# Altium project RBR-RAMON.PrjPcb
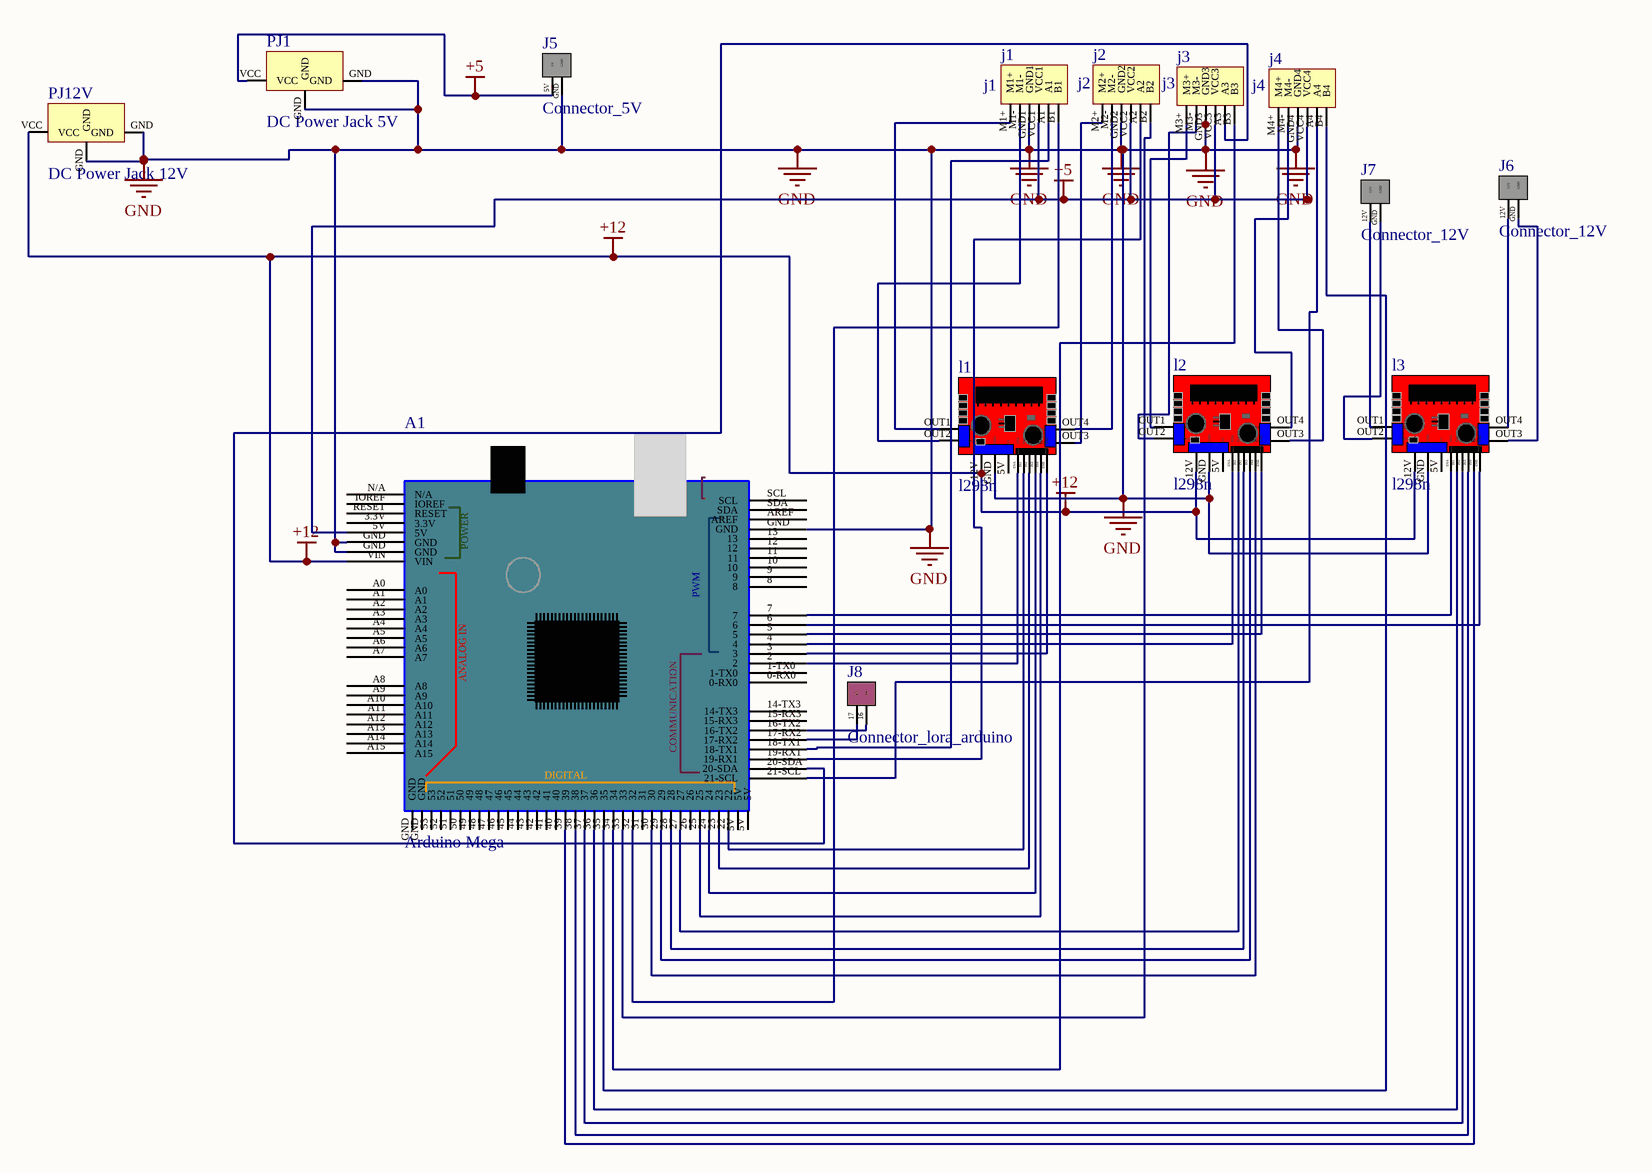
[diagram p0: RBR-RAMON.SchDoc]
2 sheets, 23 parts. Net scope: global (net labels, ports and power ports of the same name join across sheets).
Board file: RBR-RAMON2.PcbDoc
Sheets:
  RBR-RAMON.SchDoc
  Antena_lora_receptora.SchDoc

## Sheet RBR-RAMON.SchDoc
size A4; SheetNumber: 1; SheetTotal: 1

### Parts
A1  Arduino Mega  [Arduino Mega]
j1  j1  [CONECTOR JST M1]
j2  j2  [CONECTOR JST M2]
j3  j3  [CONECTOR JST M3]
j4  j4  [CONECTOR JST M4]
J5  Connector_5V  [Conector_5V]
J6  Connector_12V  [Conector_12V]
J7  Connector_12V  [Conector_12V]
J8  Connector_lora_arduino  [Conector_lora_arduino]
l1  l298n  [L298N_Conectores]
l2  l298n  [L298N_Conectores]
l3  l298n  [L298N_Conectores]
PJ1  DC Power Jack 5V  [DC Power Jack5V]
PJ12V  DC Power Jack 12V  [DC Power Jack12V]

### Nets
+5: A1.5V j1.VCC1 j2.VCC2 j3.VCC3 j4.VCC4 J5.5V PJ1.VCC
+12: A1.VIN l1.12V l2.12V l3.12V PJ12V.VCC
GND: A1.GND j1.GND1 j2.GND2 j3.GND3 j4.GND4 J5.GND l1.GND l2.GND l3.GND PJ1.GND PJ12V.GND
NetA1_2: A1.2 l1.ENA(SDA)
NetA1_3: A1.3 l1.ENB
NetA1_4: A1.4 l2.ENA(SDA)
NetA1_5: A1.5 l2.ENB
NetA1_6: A1.6 l3.ENB
NetA1_7: A1.7 l3.ENA(SDA)
NetA1_16-TX2: A1.16-TX2 J8.16
NetA1_17-RX2: A1.17-RX2 J8.17
NetA1_18-TX1: A1.18-TX1 j1.A1
NetA1_19-RX1: A1.19-RX1 j2.A2
NetA1_20-SDA: A1.20-SDA j3.A3
NetA1_21-SCL: A1.21-SCL j4.A4
NetA1_22: A1.22 l1.IN1
NetA1_23: A1.23 l1.IN2
NetA1_24: A1.24 l1.IN3
NetA1_25: A1.25 l1.IN4
NetA1_27: A1.27 l2.IN1
NetA1_28: A1.28 l2.IN2
NetA1_29: A1.29 l2.IN3
NetA1_30: A1.30 l2.IN4
NetA1_32: A1.32 j1.B1
NetA1_33: A1.33 j2.B2
NetA1_34: A1.34 j3.B3
NetA1_35: A1.35 j4.B4
NetA1_36: A1.36 l3.IN1
NetA1_37: A1.37 l3.IN2
NetA1_38: A1.38 l3.IN3
NetA1_39: A1.39 l3.IN4
Netj1_M1+: j1.M1+ l1.OUT1
Netj1_M1-: j1.M1- l1.OUT2
Netj2_M2+: j2.M2+ l1.OUT3
Netj2_M2-: j2.M2- l1.OUT4
Netj3_M3+: j3.M3+ l2.OUT1
Netj3_M3-: j3.M3- l2.OUT2
Netj4_M4+: j4.M4+ l2.OUT3
Netj4_M4-: j4.M4- l2.OUT4
NetJ6_12V: J6.12V l3.OUT4
NetJ6_GND: J6.GND l3.OUT3
NetJ7_12V: J7.12V l3.OUT1
NetJ7_GND: J7.GND l3.OUT2

Not connected (* = marked no-connect by the designer): A1 0-RX0 1-TX0 3.3V 8 9 10 11 12 13 14-TX3 15-RX3 26 31 40 41 42 43 44 45 46 47 48 49 50 51 52 53 A0 A1 A2 A3 A4 A5 A6 A7 A8 A9 A10 A11 A12 A13 A14 A15 AREF IOREF N/A RESET SCL SDA; l1 5V; l2 5V; l3 5V

### Notes on the sheet
- Labels drawn without touching a wire or pin: GND
- (in symbol Arduino Mega) POWER; PWM; ANALOG IN; COMMUNICATION; DIGITAL

### Library data of the parts
j1 = CONECTOR JST M1
j2 = CONECTOR JST M2
j3 = CONECTOR JST M3
j4 = CONECTOR JST M4

## Sheet Antena_lora_receptora.SchDoc
size A4; SheetNumber: 2; SheetTotal: 2
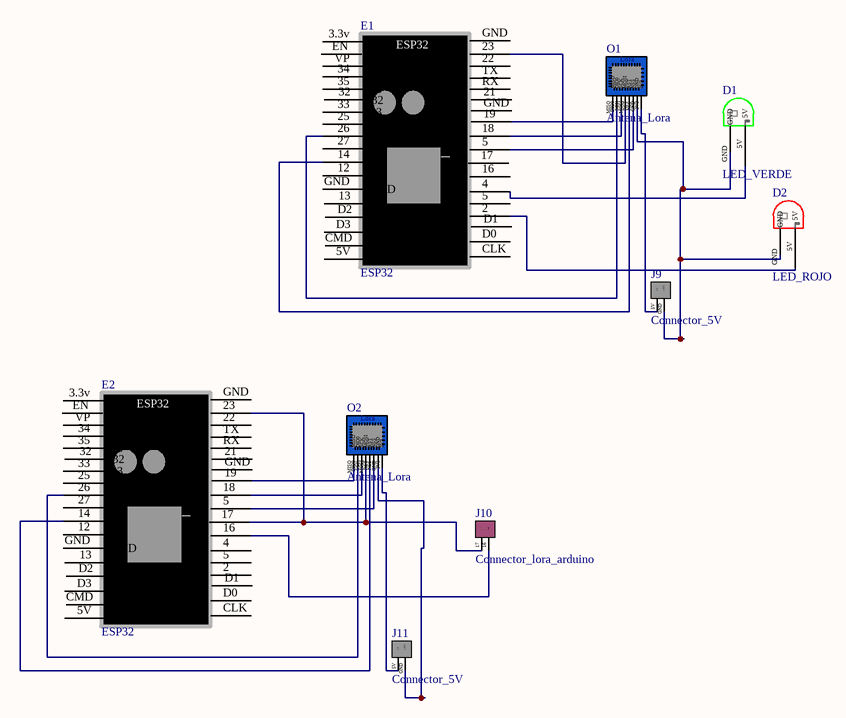
[diagram p1: Antena_lora_receptora.SchDoc]

### Parts
D1  LED_VERDE
D2  LED_ROJO
E1  ESP32
E2  ESP32
J9  Connector_5V  [Conector_5V]
J10  Connector_lora_arduino  [Conector_lora_arduino]
J11  Connector_5V  [Conector_5V]
O1  Antena_Lora
O2  Antena_Lora

### Nets
NetD1_5V: D1.5V E1.4
NetD1_GND: D1.GND D2.GND J9.GND O1.GND
NetD2_5V: D2.5V E1.2
NetE1_5: E1.5 O1.NSS
NetE1_14: E1.14 O1.RST
NetE1_18: E1.18 O1.SCK
NetE1_19: E1.19 O1.MISO
NetE1_23: E1.23 O1.MOSI
NetE1_26: E1.26 O1.DIO0
NetE2_5: E2.5 O2.NSS
NetE2_14: E2.14 O2.RST
NetE2_16: E2.16 J10.16
NetE2_17: E2.17 E2.23 J10.17 O2.MOSI
NetE2_18: E2.18 O2.SCK
NetE2_19: E2.19 O2.MISO
NetE2_26: E2.26 O2.DIO0
NetJ9_5V: J9.5V O1.3V3
NetJ11_5V: J11.5V O2.3V3
NetJ11_GND: J11.GND O2.GND

Not connected (* = marked no-connect by the designer): E1 3.3v 5V 12 13 16 17 21 22 25 27 32 33 34 35 CLK CMD D0 D1 D2 D3 EN GND RX TX VP; E2 2 3.3v 4 5V 12 13 21 22 25 27 32 33 34 35 CLK CMD D0 D1 D2 D3 EN GND RX TX VP

### Notes on the sheet
- (in symbol Antena_Lora) Lora